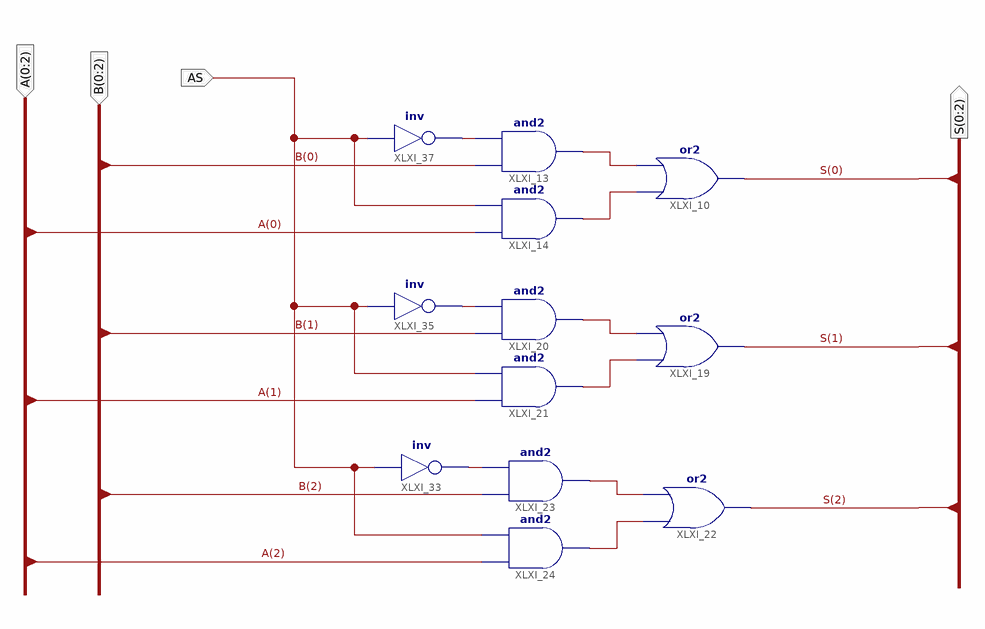
[diagram p0: schematic sheet 1]
// Xilinx ISE schematic MUX3bit_2way.sch (spartan3e) as structural Verilog: 12 symbols, 4 ports
module MUX3bit_2way (
  input  AS,
  input  [0:2] A,
  input  [0:2] B,
  output [0:2] S
);

  wire XLXN_8, XLXN_9, XLXN_12, XLXN_13, XLXN_14, XLXN_15, XLXN_21, XLXN_23, XLXN_25;

  and XLXI_14 (XLXN_9, A[0], AS);
  and XLXI_13 (XLXN_8, B[0], XLXN_25);
  or XLXI_10 (S[0], XLXN_9, XLXN_8);
  or XLXI_19 (S[1], XLXN_13, XLXN_12);
  and XLXI_20 (XLXN_12, B[1], XLXN_23);
  and XLXI_21 (XLXN_13, A[1], AS);
  or XLXI_22 (S[2], XLXN_15, XLXN_14);
  and XLXI_23 (XLXN_14, B[2], XLXN_21);
  and XLXI_24 (XLXN_15, A[2], AS);
  not XLXI_33 (XLXN_21, AS);
  not XLXI_35 (XLXN_23, AS);
  not XLXI_37 (XLXN_25, AS);
endmodule
